# EAGLE design Mirtle_myRIO _rev2 (EAGLE 7.6.0)
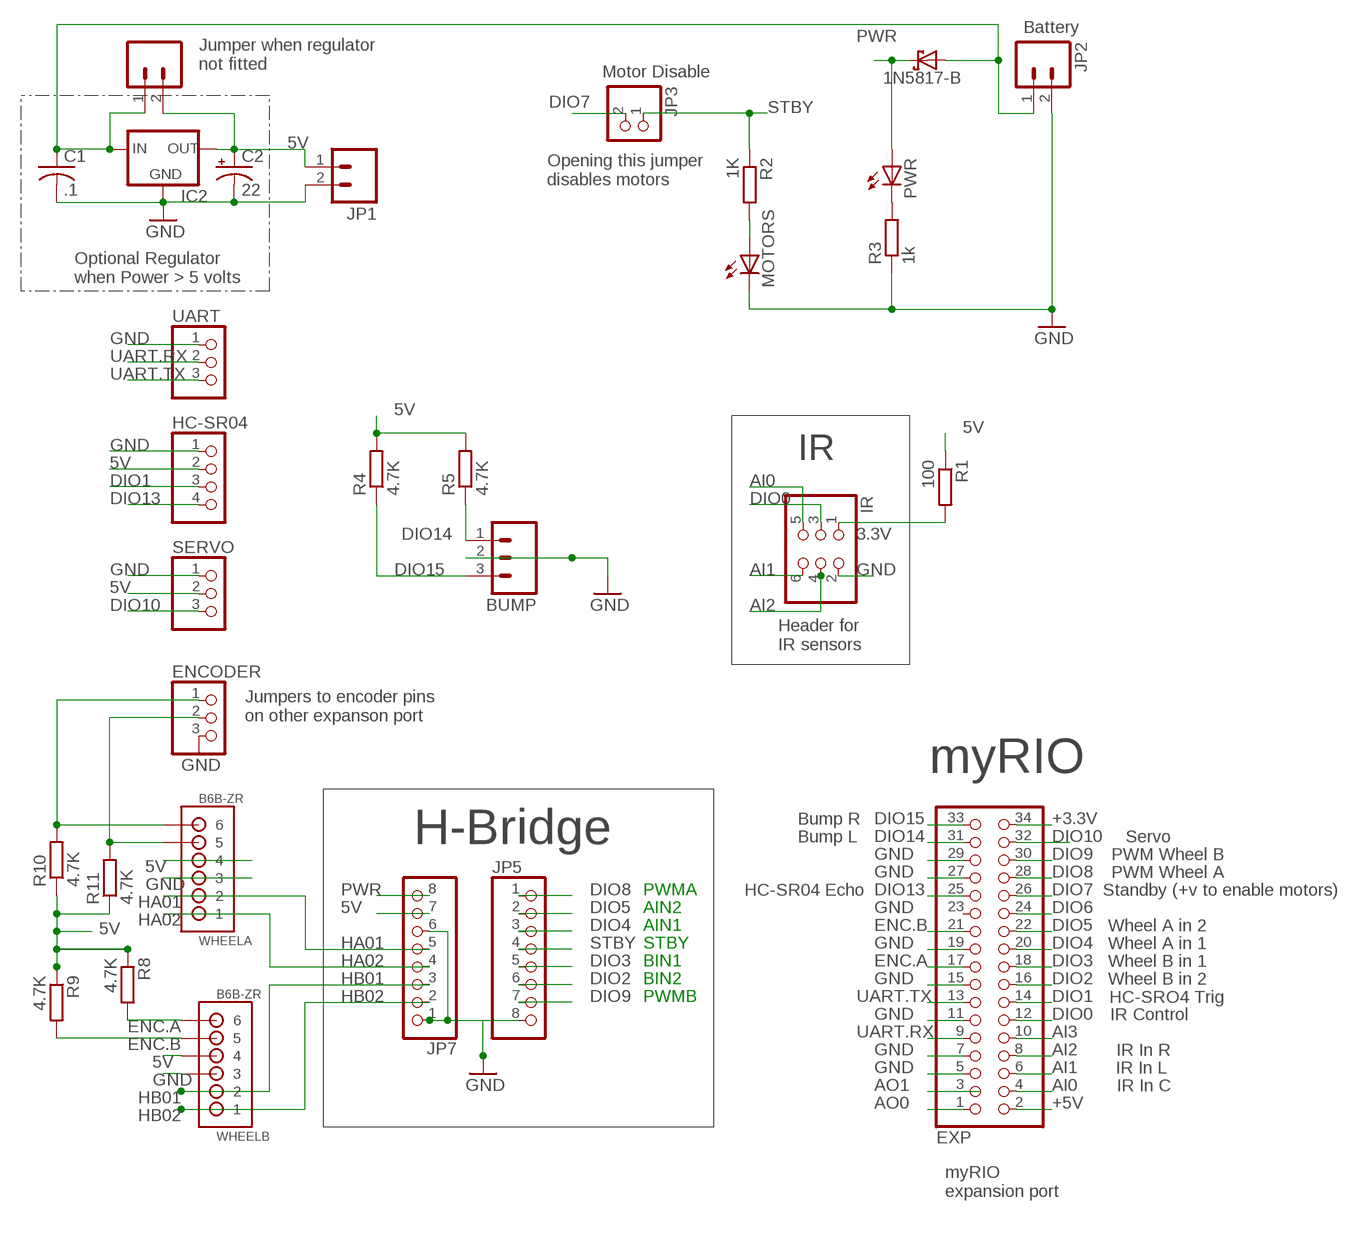
[diagram p0: schematic, sheet 1]

## Parts
5VJMPR  M02PTH  [1X02]
BUMP  M03SCREW  [SCREWTERMINAL-3.5MM-3]
C1  .1  C-US025-024X044  [C025-024X044]
C2  22  CPOL-USE2-5  [E2-5]
D1  1N5817-B  [DO41-7.6]
ENCODER  PINHD-1X3/90  [1X03/90]
EXP  PINHD-2X17/90  [2X17/90]
HC-SR04  PINHD-1X4/90  [1X04/90]
IC2  78MXXS  [78MXXS]
IR  PINHD-2X3  [2X03]
JP1  M023.5MM  [SCREWTERMINAL-3.5MM-2]
JP2  M023.5MM  [SCREWTERMINAL-3.5MM-2]
JP3  PINHD-1X2/90  [1X02/90]
JP5  PINHD-1X8CLEANBIG  [1X08-CLEANBIG]
JP7  PINHD-1X8CLEANBIG  [1X08-CLEANBIG]
MOTORS  LED3MM  [LED3MM]
PWR  LED3MM  [LED3MM]
R1  100  R-EU_0204/7  [0204/7]
R2  1K  R-EU_0204/7  [0204/7]
R3  1k  R-EU_0204/7  [0204/7]
R4  4.7K  R-EU_0204/7  [0204/7]
R5  4.7K  R-EU_0204/7  [0204/7]
R8  4.7K  R-EU_0204/7  [0204/7]
R9  4.7K  R-EU_0204/7  [0204/7]
R10  4.7K  R-EU_0204/7  [0204/7]
R11  4.7K  R-EU_0204/7  [0204/7]
SERVO  PINHD-1X3/90  [1X03/90]
UART  PINHD-1X3/90  [1X03/90]
WHEELA  B6B-ZR  [B6B-ZR]
WHEELB  B6B-ZR  [B6B-ZR]

## Nets
3.3V: IR.1 R1.2
5V: 5VJMPR.2 C2.+ HC-SR04.2 IC2.OUT JP1.1 JP7.7 R1.1 R4.2 R5.2 R8.1 R9.1 R10.1 R11.1 SERVO.2 WHEELA.4 WHEELB.4
+3.3V: EXP.34
+5V: EXP.2
AI0: EXP.4 IR.5
AI1: EXP.6 IR.6
AI2: EXP.8 IR.4
AI3: EXP.10
AO0: EXP.1
AO1: EXP.3
BAT+V: 5VJMPR.1 C1.1 D1.A IC2.IN JP2.1
D31: ENCODER.1 R10.2 WHEELA.6
DIO0: EXP.12 IR.3
DIO1: EXP.14 HC-SR04.3
DIO2: EXP.16 JP5.6
DIO3: EXP.18 JP5.5
DIO4: EXP.20 JP5.3
DIO5: EXP.22 JP5.2
DIO6: EXP.24
DIO7: EXP.26 JP3.2
DIO8: EXP.28 JP5.1
DIO9: EXP.30 JP5.7
DIO10: EXP.32 SERVO.3
DIO13: EXP.25 HC-SR04.4
DIO14: BUMP.1 EXP.31 R5.1
DIO15: BUMP.3 EXP.33 R4.1
ENC.A: EXP.17 R8.2 WHEELB.6
ENC.B: EXP.21 R9.2 WHEELB.5
GND: BUMP.2 C1.2 C2.- ENCODER.3 EXP.5 EXP.7 EXP.11 EXP.15 EXP.19 EXP.27 EXP.29 HC-SR04.1 IC2.GND IR.2 JP1.2 JP2.2 JP5.8 JP7.1 JP7.6 MOTORS.K(C) R3.1 SERVO.1 UART.1 WHEELA.3 WHEELB.3
HA01: JP7.5 WHEELA.2
HA02: JP7.4 WHEELA.1
HB01: JP7.3 WHEELB.2
HB02: JP7.2 WHEELB.1
N$3: PWR.K(C) R3.2
N$5: ENCODER.2 R11.2 WHEELA.5
N$8: MOTORS.A R2.2
PWR: D1.C JP7.8 PWR.A
STBY: JP3.1 JP5.4 R2.1
UART.RX: EXP.9 UART.2
UART.TX: EXP.13 UART.3
Unconnected: EXP.23

## Notes on the sheet
- Battery
- Motor Disable
- Jumper when regulator
  not fitted
- Opening this jumper
  disables motors
- Optional Regulator
  when Power > 5 volts
- IR
- Header for
  IR sensors
- Jumpers to encoder pins
  on other expanson port
- myRIO
- Bump R
- H-Bridge | Bump L | Servo
- PWM Wheel B
- PWM Wheel A
- PWMA | HC-SR04 Echo | Standby (+v to enable motors)
- AIN2
- AIN1 | Wheel A in 2
- STBY | Wheel A in 1
- BIN1 | Wheel B in 1
- BIN2 | Wheel B in 2
- HC-SRO4 Trig
- PWMB
- IR Control
- IR In R
- IR In L
- IR In C
- myRIO
  expansion port

## Library data of the parts
5VJMPR JP1 JP2 = SparkFun-Connectors:M02: Standard 2-pin 0.1" header. Use with - straight break away headers ( PRT-00116) - right angle break away headers (PRT-00553) - swiss pins (PRT-00743) - machine pins (PRT-00117) - female headers (PRT-00115) Molex polarized connector foot print use with: PRT-08233 with associated crimp pins and housings. 2.54_SCREWTERM for use with PRT-10571. 3.5mm Screw Terminal footprints for PRT-08084 5mm Screw Terminal footprints for use with PRT-08433
BUMP = SparkFun-Connectors:M03: Header 3 Standard 3-pin 0.1" header. Use with straight break away headers (SKU : PRT-00116), right angle break away headers (PRT-00553), swiss pins (PRT-00743), machine pins (PRT-00117), and female headers (PRT-00115). Molex polarized connector foot print use with SKU : PRT-08232 with associated crimp pins and housings.
C1 = rcl:C-US: CAPACITOR, American symbol
C2 = rcl:CPOL-US: POLARIZED CAPACITOR, American symbol
D1 = diode:1N581*: 1.0A SCHOTTKY BARRIER RECTIFIER Source: http://www.diodes.com/datasheets/ds23001.pdf
ENCODER SERVO UART = pinhead:PINHD-1X3: PIN HEADER
EXP = pinhead:PINHD-2X17: PIN HEADER
HC-SR04 = pinhead:PINHD-1X4: PIN HEADER
IC2 = v-reg:78MXXS: VOLTAGE REGULATOR
IR = pinhead:PINHD-2X3: PIN HEADER
JP3 = pinhead:PINHD-1X2: PIN HEADER
JP5 JP7 = adafruit:PINHD-1X8: PIN HEADER
MOTORS PWR = led:LED: LED OSRAM: - CHIPLED LG R971, LG N971, LY N971, LG Q971, LY Q971, LO R971, LY R971 LH N974, LH R974 LS Q976, LO Q976, LY Q976 LO Q996 - Hyper CHIPLED LW Q18S LB Q993, LB Q99A, LB R99A - SideLED LS A670, LO A670, LY A670, LG A670, LP A670 LB A673, LV A673, LT A673, LW A673 LH A674 LY A675 LS A676, LA A676, LO A676, LY A676, LW A676 LS A679, LY A679, LG A679 - Hyper Micro SIDELED® LS Y876, LA Y876, LO Y876, LY Y876 LT Y87S - SmartLED LW L88C, LW L88S LB L89C, LB L89S, LG L890 LS L89K, LO L89K, LY L89K LS L896, LA L896, LO L896, LY L896 - TOPLED LS T670, LO T670, LY T670, LG T670, LP T670 LSG T670, LSP T670, LSY T670, LOP T670, LYG T670 LG T671, LOG T671, LSG T671 LB T673, LV T673, LT T673, LW T673 LH T674 LS T676, LA T676, LO T676, LY T676, LB T676, LH T676, LSB T676, LW T676 LB T67C, LV T67C, LT T67C, LS T67K, LO T67K, LY T67K, LW E67C LS E67B, LA E67B, LO E67B, LY E67B, LB E67C, LV E67C, LT E67C LW T67C LS T679, LY T679, LG T679 LS T770, LO T770, LY T770, LG T770, LP T770 LB T773, LV T773, LT T773, LW T773 LH T774 LS E675, LA E675, LY E675, LS T675 LS T776, LA T776, LO T776, LY T776, LB T776 LHGB T686 LT T68C, LB T68C - Hyper Mini TOPLED® LB M676 - Mini TOPLED Santana® LG M470 LS M47K, LO M47K, LY M47K Source: http://www.osram.convergy.de LUXEON: - LUMILED® LXK2-PW12-R00, LXK2-PW12-S00, LXK2-PW14-U00, LXK2-PW14-V00 LXK2-PM12-R00, LXK2-PM12-S00, LXK2-PM14-U00 LXK2-PE12-Q00, LXK2-PE12-R00, LXK2-PE12-S00, LXK2-PE14-T00, LXK2-PE14-U00 LXK2-PB12-K00, LXK2-PB12-L00, LXK2-PB12-M00, LXK2-PB14-N00, LXK2-PB14-P00, LXK2-PB14-Q00 LXK2-PR12-L00, LXK2-PR12-M00, LXK2-PR14-Q00, LXK2-PR14-R00 LXK2-PD12-Q00, LXK2-PD12-R00, LXK2-PD12-S00 LXK2-PH12-R00, LXK2-PH12-S00 LXK2-PL12-P00, LXK2-PL12-Q00, LXK2-PL12-R00 Source: www.luxeon.com KINGBRIGHT: KA-3528ASYC Source: www.kingbright.com
R1-R5 R8-R11 = resistor:R-EU_: RESISTOR, European symbol
WHEELA WHEELB = jst:B6B-ZR: JST-ZH Connector 6 pol, 1.5mm pitch Package: B6B-ZR Source: http://www.jst-mfg.com/product/pdf/eng/eZH.pdf

## Net classes
1 power: width 0.305 mm, clearance 0.305 mm

## Board
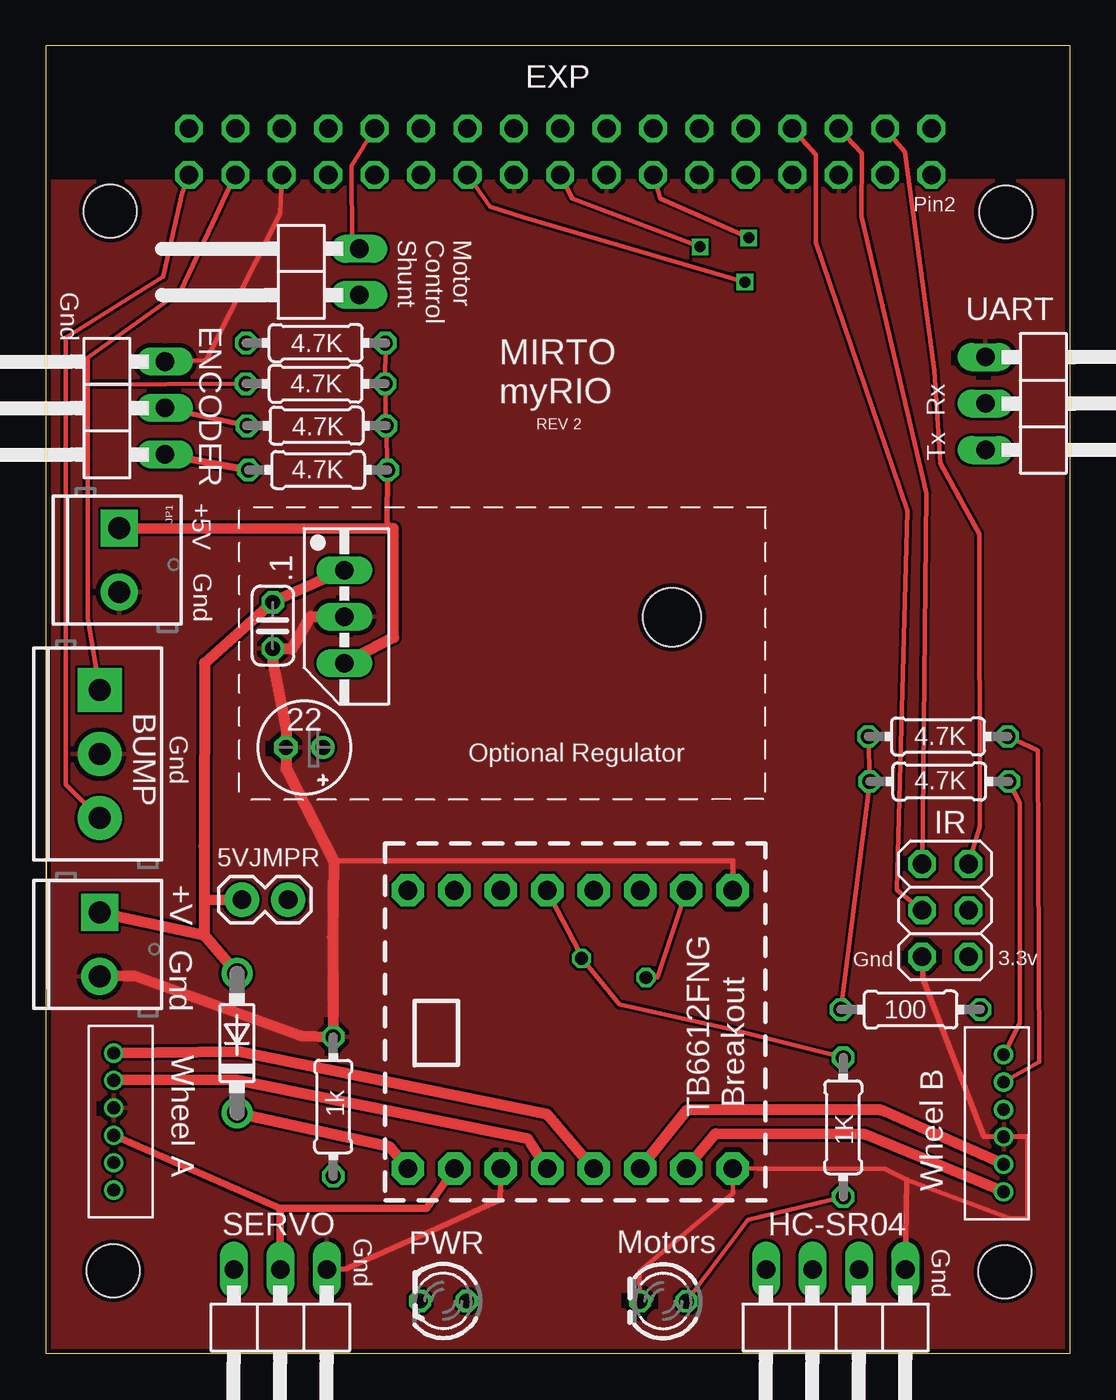
[diagram p1: board, top side]
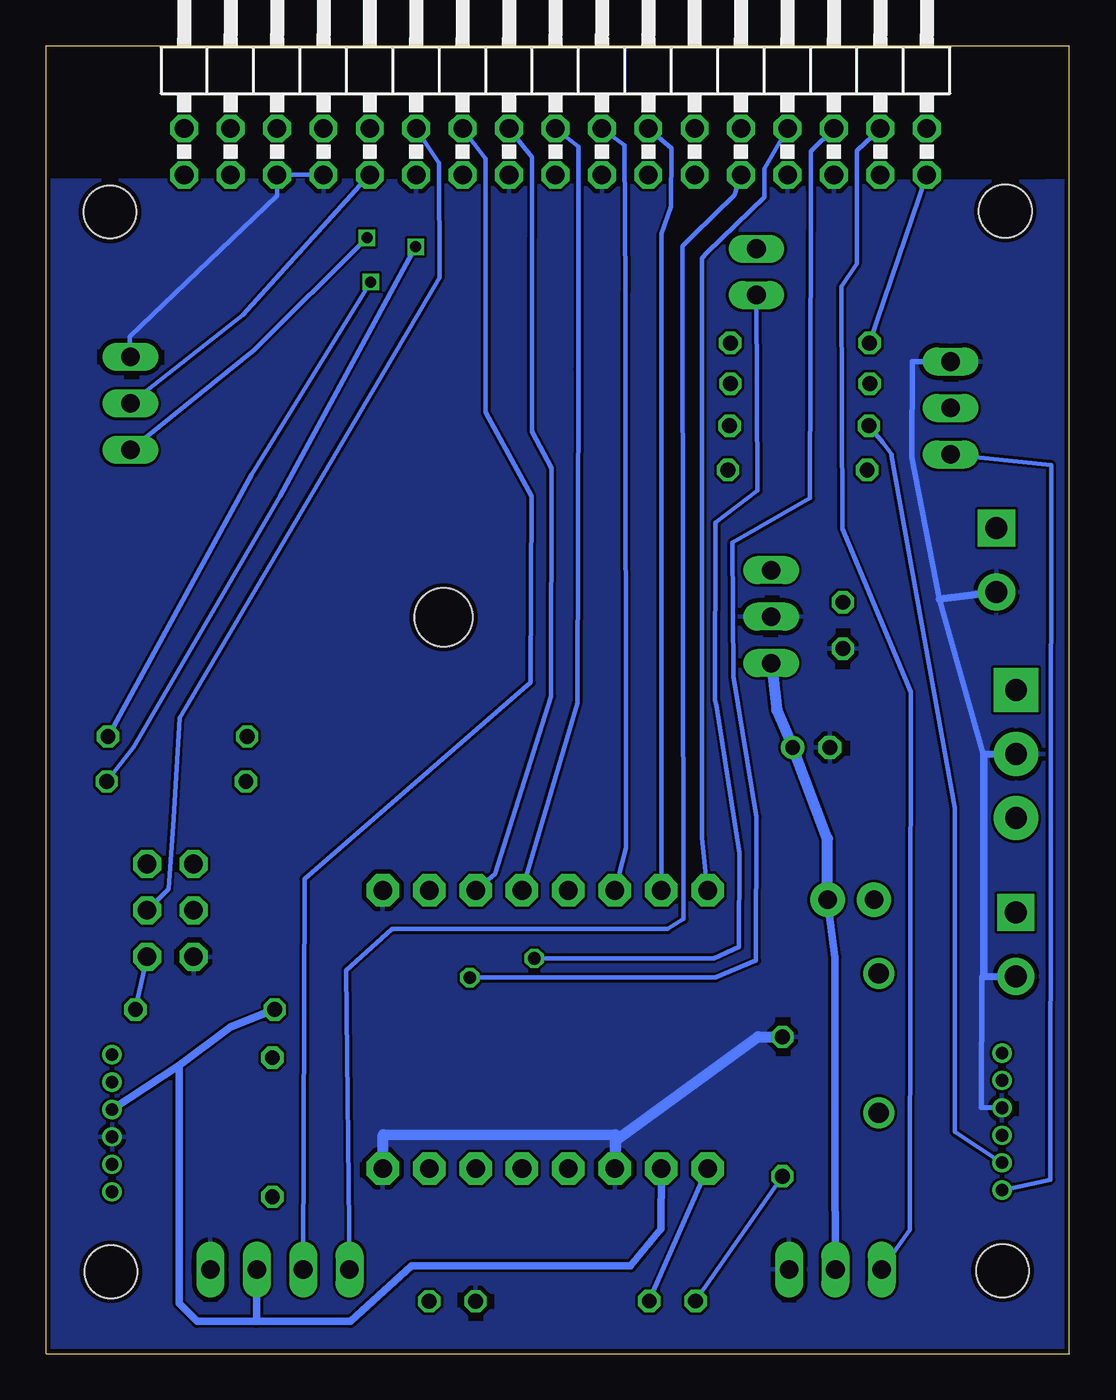
[diagram p2: board, bottom side, seen from below]

Size 56.06 x 71.59 mm. Coordinates in mm from the lower left corner, seen from the top.
Outline: 0.04,0.01 0.04,71.59 56.06,71.59 56.05,0.01
Outline: 56.02,0 0,0
Copper layers (1*2*15*16): Top 0.035mm / dielectric 0.2mm / Route2 0.0175mm / dielectric 1.1mm / Route15 0.0175mm / dielectric 0.2mm / Bottom 0.035mm
Design rules "SeeedStudio_DRU_no_angle": minimum track width 6mil, minimum drill 12mil, track to track 6mil, track to pad 6mil, pad to pad 6mil, via to via 6mil, smd to smd 0mil, copper to edge 10mil, drill to drill 10mil, minimum pad ring 6mil, minimum via ring 6mil, stop-mask expansion 2mil, vias tented up to drill 25mil, thermal gap 10mil
Holes 2.9 mm at 52.54,62.49 3.69,4.54 3.54,62.54 52.49,4.49
Holes 3.2 mm at 34.28,40.31
tRestrict: area 2.5,21.1 to 3.4,21.9; area 2.6,19.4 to 3.4,20.2; area 23.8,9.7 to 24.6,10.5; area 25.3,9.7 to 26.1,10.5; area 37.2,10.5 to 38,11.3; area 36.4,9.7 to 37.3,10.5; area 46.8,21.3 to 47.6,22.1; area 48.2,21.3 to 49,22.1; area 2.5,33.5 to 3.4,34.3; area 2.6,31.4 to 3.4,32.2; area 36.5,24.9 to 37.3,25.7; area 37.9,25 to 38.7,25.8; 27 more areas
bRestrict: area 2.5,31.4 to 3.2,32.2; area 1.7,20.3 to 2.5,21.1; area 2.6,21.1 to 3.4,21.9; area 2.5,19.4 to 3.3,20.2; area 25.2,9.7 to 26,10.5; area 23.7,9.8 to 24.5,10.5; area 36.5,9.8 to 37.3,10.6; area 47.5,22 to 48.3,22.8; area 48.2,21.3 to 49,22.1; area 37.9,25 to 38.7,25.8; area 37.2,25.7 to 38,26.5; area 36.5,25 to 37.3,25.8; 28 more areas

### Footprints (pad centres in the part's own frame; a part is rotated, then mirrored left to right if it is on the bottom)
1X02 = drill 1.016 pad 1.88: 1 0,0; 2 2.54,0
SCREWTERMINAL-3.5MM-3 = drill 1.2 pad 2.413 square: 1 0,0 | drill 1.2 pad 2.413: 2 3.5,0; 3 7,0
C025-024X044 = drill 0.813 octagon: 1 -1.27,0; 2 1.27,0
E2-5 = drill 0.813 pad 1.27: + -1.016,0 | drill 0.813 pad 1.27 octagon: - 1.016,0
DO41-7.6 = drill 1.1 pad 1.7: A 3.81,0; C -3.81,0
1X03/90 = drill 1.016 long: 1 -2.54,-3.81; 2 0,-3.81; 3 2.54,-3.81
2X17/90 = drill 1.016 octagon: 1 -20.32,-6.35; 2 -20.32,-3.81; 3 -17.78,-6.35; 4 -17.78,-3.81; 5 -15.24,-6.35; 6 -15.24,-3.81; 7 -12.7,-6.35; 8 -12.7,-3.81; 9 -10.16,-6.35; 10 -10.16,-3.81; 11 -7.62,-6.35; 12 -7.62,-3.81; 13 -5.08,-6.35; 14 -5.08,-3.81; 15 -2.54,-6.35; 16 -2.54,-3.81; 17 0,-6.35; 18 0,-3.81; 19 2.54,-6.35; 20 2.54,-3.81; 21 5.08,-6.35; 22 5.08,-3.81; 23 7.62,-6.35; 24 7.62,-3.81; 25 10.16,-6.35; 26 10.16,-3.81; 27 12.7,-6.35; 28 12.7,-3.81; 29 15.24,-6.35; 30 15.24,-3.81; 31 17.78,-6.35; 32 17.78,-3.81; 33 20.32,-6.35; 34 20.32,-3.81
1X04/90 = drill 1.016 long: 1 -3.81,-3.81; 2 -1.27,-3.81; 3 1.27,-3.81; 4 3.81,-3.81
78MXXS = drill 1.016 long: GND 0,-2.54; IN -2.54,-2.54; OUT 2.54,-2.54
2X03 = drill 1.016 octagon: 1 -2.54,-1.27; 2 -2.54,1.27; 3 0,-1.27; 4 0,1.27; 5 2.54,-1.27; 6 2.54,1.27
SCREWTERMINAL-3.5MM-2 = drill 1.2 pad 2.032 square: 1 0,0 | drill 1.2 pad 2.032: 2 3.5,0
1X02/90 = drill 1.016 long: 1 -1.27,-3.81; 2 1.27,-3.81
1X08-CLEANBIG = drill 1.016 pad 1.778 octagon: 1 -8.89,0; 2 -6.35,0; 3 -3.81,0; 4 -1.27,0; 5 1.27,0; 6 3.81,0; 7 6.35,0; 8 8.89,0
LED3MM = drill 0.813 octagon: A -1.27,0; K 1.27,0
0204/7 = drill 0.813 octagon: 1 -3.81,0; 2 3.81,0
B6B-ZR = drill 0.7: 1 9,-1.3; 2 7.5,-1.3; 3 6,-1.3; 4 4.5,-1.3; 5 3,-1.3; 6 1.5,-1.3

### Placement (x,y rotation side)
5VJMPR  10.73,24.85 0 top
BUMP  2.95,36.32 270 top
C1  12.43,39.86 270 top
C2  14.16,33.18 180 top
D1  10.47,17 90 top
ENCODER  2.72,51.76 90 top
EXP  28.16,70.87 0 bottom
HC-SR04  43.24,0.81 180 top
IC2  18.89,40.34 270 top
IR  49.24,24.27 90 top
JP1  4.02,45.19 270 top
JP2  2.96,24.15 270 top
JP3  13.35,59.21 90 top
JP5  28.72,25.36 0 top
JP7  28.72,10.14 180 top
MOTORS  33.8,2.88 180 top
PWR  21.76,2.89 180 top
R1  47.34,18.84 0 top
R2  43.65,12.4 270 top
R3  15.74,13.53 270 top
R4  14.78,55.32 0 top
R5  14.77,53.09 0 top
R8  48.91,31.32 0 top
R9  48.84,33.79 0 top
R10  14.91,48.37 180 top
R11  14.82,50.79 180 top
SERVO  12.84,0.81 180 top
UART  55.24,52.01 270 top
WHEELA  2.42,7.46 90 top
WHEELB  53.73,17.87 270 top

### Tracks (layer width: path | path; a pad name or v marks a point on that pad's centre or on a via)
3.3V
  Bottom 0.254: R1.2 IR.1
5V
  Top 0.254: R9.1 R8.1 R1.1 | R4.2 R5.2 R11.1 R10.1
  Top 0.305: 19.03,45.17 18.68,45.47 R10.1
  Top 0.406: WHEELA.4 12.83,7.97 | 12.83,7.97 20.85,7.97 JP7.7 | 12.83,7.97 SERVO.2
  Top 0.61: JP1.1 19.03,45.17 19.05,39.19 IC2.OUT
  Bottom 0.406: 44.52,1.77 39.38,1.78 36.04,4.81 24.04,4.81 22.38,6.85 JP7.7 | 44.52,1.77 47.76,1.77 48.76,2.77 48.77,15.8 | 48.77,15.8 45.94,17.88 R1.1 | HC-SR04.2 44.52,1.77 | WHEELB.4 48.77,15.8 | SERVO.2 12.87,11.01 12.86,21.7 5VJMPR.2 | IC2.OUT 16.38,37.8
  Bottom 0.61: 5VJMPR.2 13.27,28.19 C2.+ 16.04,35.21 IC2.OUT
AI0
  Top 0.254: IR.5 51.13,28.85 51.09,44.86 48.97,48.74 48.63,53.8 47.03,65.8 EXP.4
AI1
  Top 0.254: IR.6 48.2,47.11 44.65,62.27 44.68,65.7 EXP.6
AI2
  Top 0.254: IR.4 46.58,25.38 47.16,46.14 42.15,60.82 42.15,65.62 EXP.8
BAT+V
  Top 0.61: JP2.1 8.67,22.93 | 8.67,22.93 D1.A | IC2.IN C1.1 8.69,37.81 8.67,27.78 8.68,24.81 | 8.68,24.81 8.67,22.93 | 5VJMPR.1 8.68,24.81
  Bottom 0.406: IC2.IN 16.38,42.88
D31
  Top 0.406: ENCODER.1 R10.2
  Bottom 0.254: WHEELA.6 1.07,9.53 1.03,48.64 ENCODER.1
DIO0
  Bottom 0.254: EXP.12 34.52,65.15 34.51,58.89 48.73,34.8 49.06,29.31 49.33,25.43 IR.3
DIO1
  Bottom 0.254: HC-SR04.3 41.9,25.99 29.52,36.73 29.48,46.93 31.98,51.54 31.98,65.41 EXP.14
DIO2
  Bottom 0.254: JP5.6 31.46,26.27 28.39,35.98 28.38,48.46 29.44,50.48 29.43,61.11 29.43,65.48 EXP.16
DIO3
  Bottom 0.254: JP5.5 26.96,35.62 26.91,53.87 26.9,66.07 EXP.18
DIO4
  Bottom 0.254: JP5.3 24.3,27.68 24.34,58.08 24.37,66.14 EXP.20
DIO5
  Bottom 0.254: JP5.2 22.35,61.31 21.83,62.78 21.82,65.98 EXP.22
DIO7
  Top 0.254: EXP.26 16.74,65.01 16.76,60.65 JP3.2
DIO8
  Bottom 0.254: JP5.1 20.13,28.24 20.14,59.95 19.87,60.26 16.72,63.29 16.72,64.87 EXP.28
DIO9  (via drill 0.7)
  Top 0.254: v32.85,20.59 33.47,20.59 JP5.7
  Bottom 0.254: v32.85,20.59 19.4,20.59 17.18,21.52 17.15,29.37 18.43,37.08 18.47,44.41 14.22,46.83 14.18,61.44 14.19,63.72 14.19,65.81 EXP.30
DIO10
  Bottom 0.254: SERVO.3 8.75,6.8 8.72,36.22 12.45,45.16 12.51,58.4 11.67,59.65 11.67,65.85 EXP.32
DIO13
  Bottom 0.254: HC-SR04.4 39.61,20.99 37.1,23.24 22.02,23.24 21.14,23.79 21.2,59.29 21.21,60.61 20.61,61.22 18.37,63.4 EXP.25
DIO14
  Top 0.254: BUMP.1 2.29,40.29 2.3,53.05 | 2.3,53.05 2.31,54.52 6.12,57.25 7.38,58.16 9.11,61.83 EXP.31 | R5.1 2.3,53.05
DIO15
  Top 0.254: BUMP.3 1.1,31.15 1.1,55.61 6.44,58.94 7.46,63.51 EXP.33
  Bottom 0.254: R4.1 EXP.33
ENC.A  (via drill 0.6)
  Top 0.254: WHEELB.6 53.31,18.11 53.31,30.14 R8.2 | v35.81,60.58 28.84,63.21 EXP.17
  Bottom 0.254: R8.2 51.24,33.22 43.23,46.94 v35.81,60.58
ENC.B  (via drill 0.6)
  Top 0.254: WHEELB.5 54.37,15.97 54.3,33.01 R9.2 | v38.27,58.66 26.22,62.18 24.32,62.77 EXP.21
  Bottom 0.254: R9.2 44.8,48.12 v38.27,58.66
GND
  Top 0.254: 53.67,11.88 53.62,11.88 WHEELB.3 53.72,11.85 53.73,7.41 52.69,7.45 47.13,9.52 45.92,10.13 38.98,10.13 JP7.1 37.61,8.78 32.5,4.51 MOTORS.K | ENCODER.3 8.78,54.37 12.84,62.41 EXP.29
  Top 0.305: JP7.6 24.88,8.42 21.36,6.85 16.43,4.66 SERVO.1 | HC-SR04.1 47.13,9.52 | JP5.8 37.61,26.96 15.75,26.98 | 53.67,11.88 51.34,11.91 48,20.55 IR.2
  Top 0.61: JP2.2 4.85,20.67 13.95,17.41 R3.1 15.72,18.96 15.7,22.81 15.75,26.98 13.15,32.03 13.15,32.83 C2.- 13.15,34.17 12.43,37.88 C1.2 13.49,38.59 14.51,40.35 IC2.GND
  Bottom 0.254: UART.1 51.46,55.66 43.39,63.37 EXP.5 EXP.7
  Bottom 0.305: WHEELA.3 4.85,13.48 4.82,20.62 JP2.2 | ENCODER.3 8.63,54.29 8.65,49.05 7.15,41.3 4.78,32.87 BUMP.2
  Bottom 0.406: JP2.2 4.71,20.64 4.71,32.81 BUMP.2 | IC2.GND 16.38,40.34 | JP1.2 7.15,41.3
  Bottom 0.61: JP7.1 37.59,11.99 24.88,12.01 JP7.6 24.89,11.63 17.06,17.35 R3.1
  pour Top: 0.04,0.01 0.12,64.15 1.78,64.16 55.92,64.2 55.92,0.01
  pour Bottom: 0.04,0.01 0.12,64.19 2.58,64.16 55.91,64.23 55.92,63.69 55.92,0.01
HA01
  Top 0.61: JP7.5 26.37,11.78 10.46,14.99 WHEELA.2
HA02
  Top 0.61: WHEELA.1 10.62,16.55 27.43,13.12 JP7.4
HB01
  Top 0.61: WHEELB.2 45.7,13.34 35.1,13.34 JP7.3
HB02
  Top 0.61: WHEELB.1 44.84,12.01 36.66,12.04 JP7.2
N$3
  Bottom 0.254: R3.2 PWR.K
N$5
  Top 0.305: ENCODER.2 R11.2
  Bottom 0.254: WHEELA.5 6.31,12.15 6.31,29.87 9.77,49.19 9.76,49.21 10.24,49.86 R11.2
N$8
  Top 0.254: R2.2 38.43,7.32 MOTORS.A
PWR
  Top 0.61: D1.C 18.81,11.35 JP7.8
  Bottom 0.254: JP7.8 PWR.A
STBY  (via drill 0.7)
  Top 0.254: 29.45,21.51 31.4,19.11 37.52,17.76 R2.1 | 29.45,21.51 JP5.4 | v29.32,21.64 29.45,21.51
  Bottom 0.254: JP3.1 17.1,47.23 19.39,45.5 19.43,35.79 19.35,35.47 18.09,27.4 18.11,22.28 19.49,21.64 v29.32,21.64
UART.RX
  Bottom 0.254: UART.2 45.27,56.84 EXP.9
UART.TX  (via drill 0.6)
  Top 0.254: v38.48,61.08 33.64,63.21 EXP.13
  Bottom 0.254: UART.3 44.61,54.95 v38.48,61.08

### Text on the board
tPlace: TB6612FNG / Breakout
tNames: Pin2 | Motor / Control / Shunt | Gnd | MIRTO / myRIO | REV 2 | Rx | Tx | +5V | Gnd | Gnd | Optional Regulator | +V | Gnd | Gnd | 3.3v | Wheel A | Wheel B | Gnd | Motors | Gnd | PWR
Document: Mod for new pinout: / cut trace to pin 4 and connect to pin 2 / cut trace from servo and connect to pin 4 (note wrong labels for servo pins) / connect trace to 20 (A6) - note pin 6 and 20 swapped in code